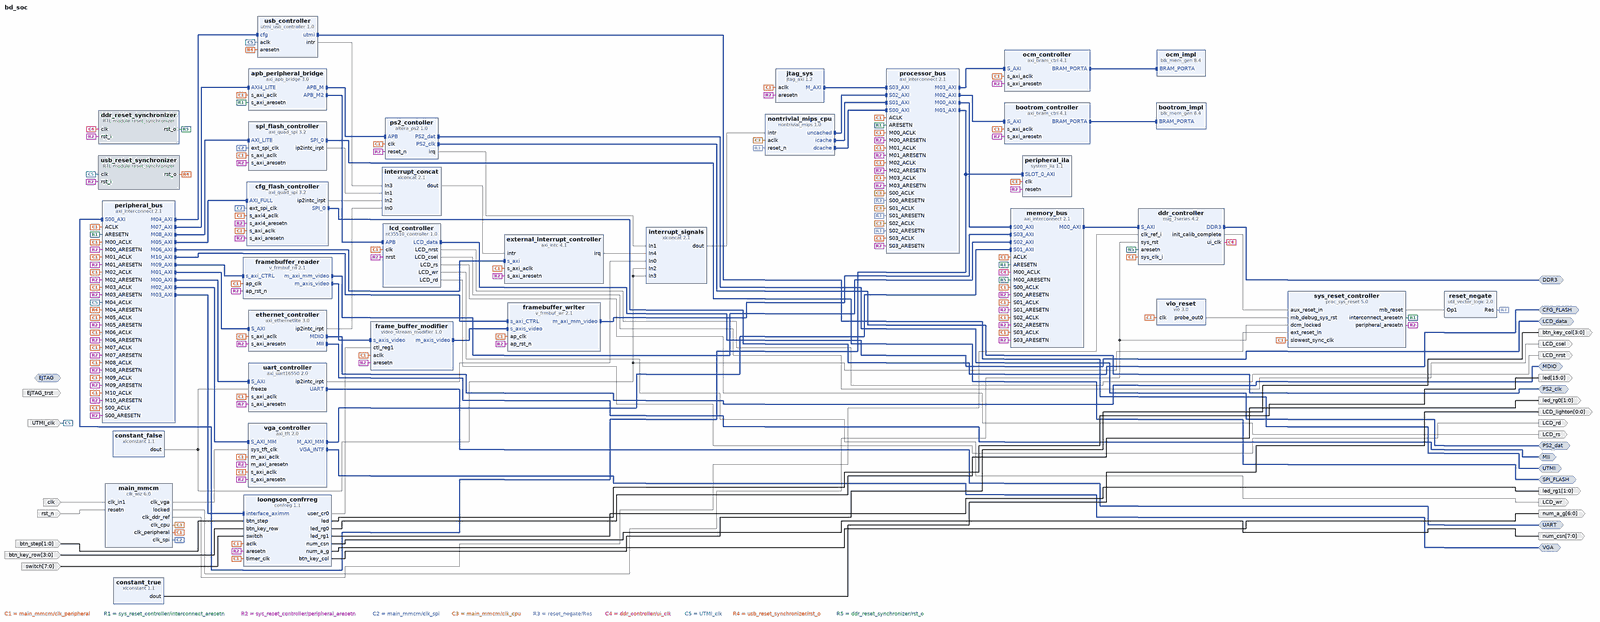
[diagram p0: block diagram of the top level, whole]
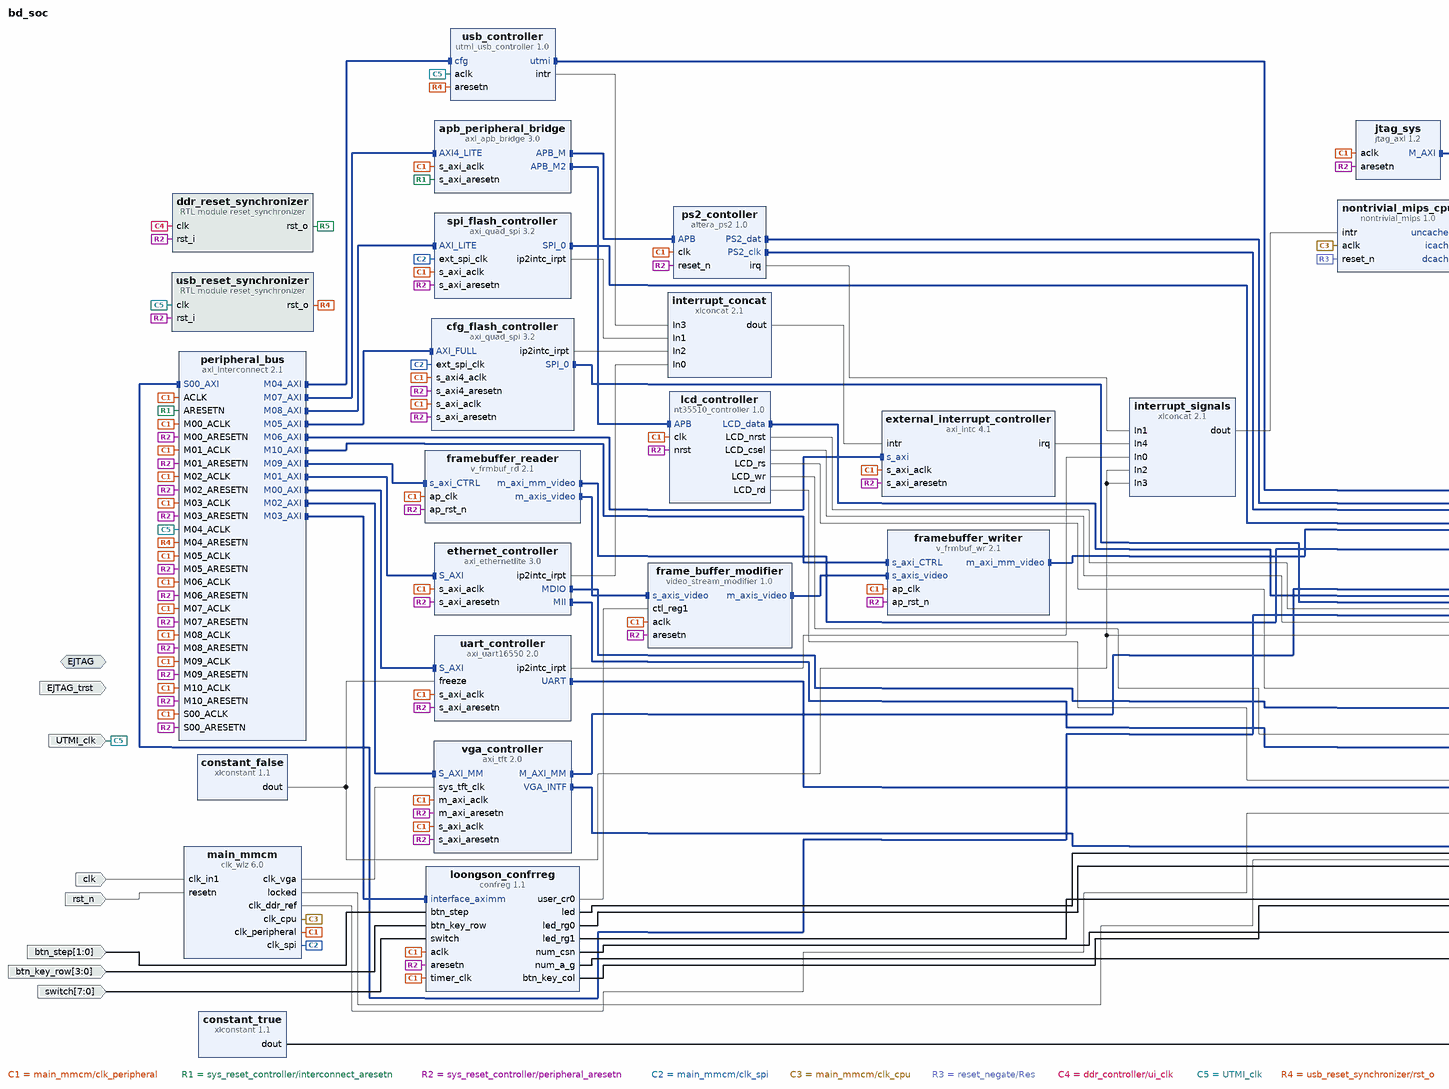
[diagram p1: block diagram of the top level, left part]
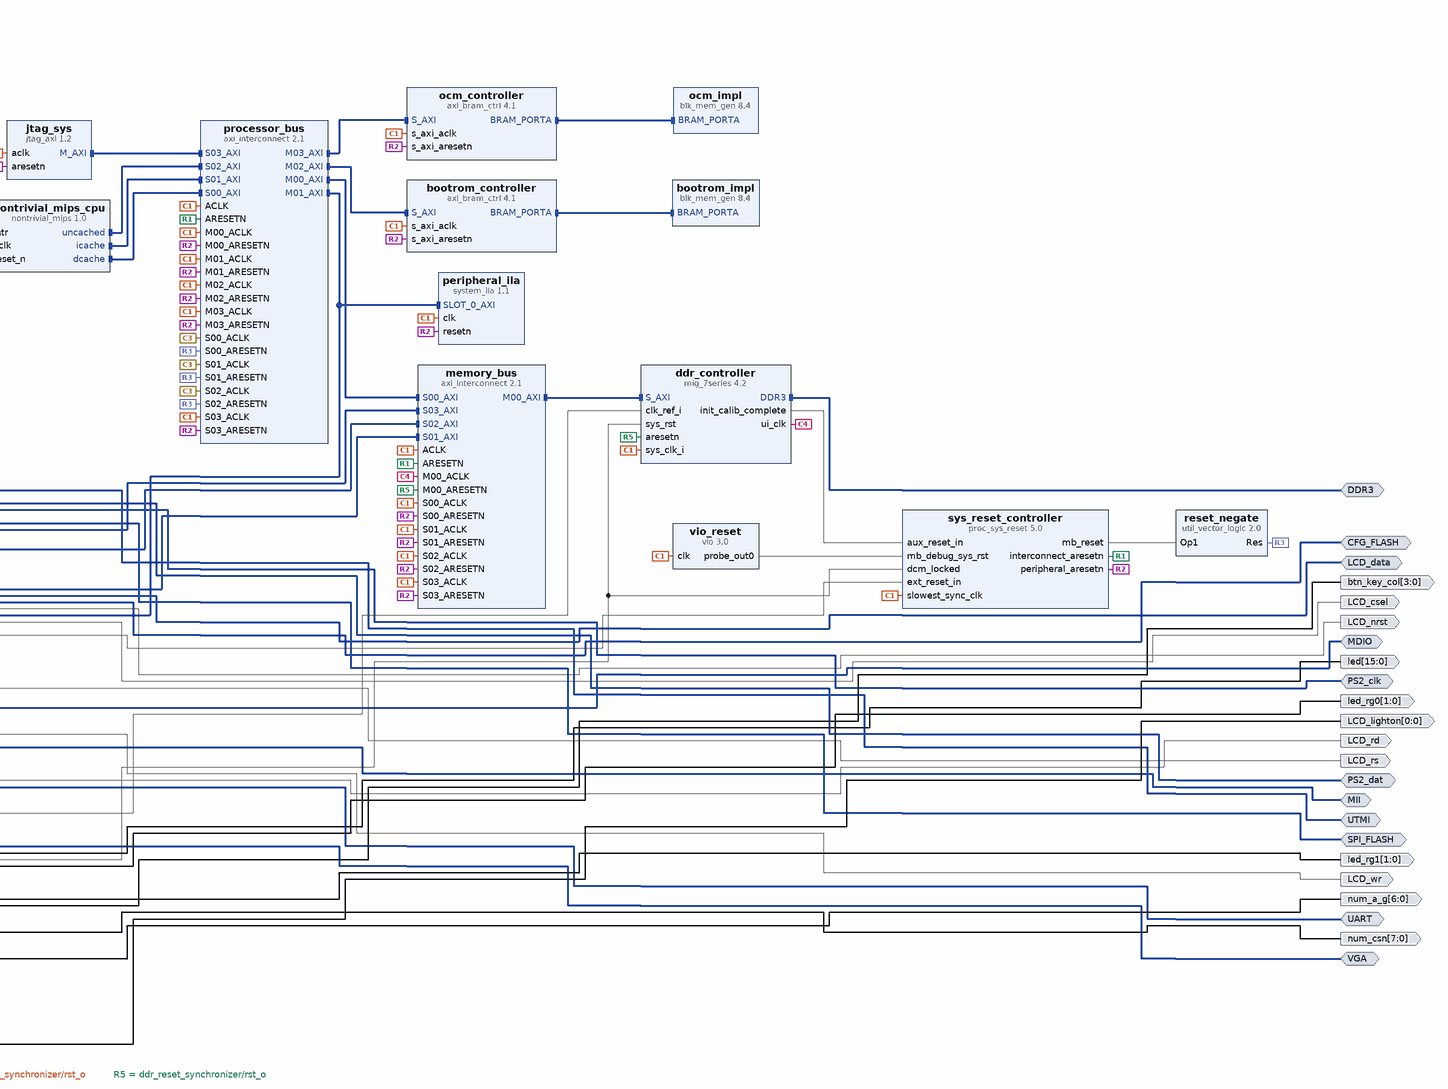
[diagram p2: block diagram of the top level, right part]
# Vivado block design bd_soc, xc7a200tfbg676-2, Vivado 2018.3
create_bd_design bd_soc

create_bd_intf_port -mode Master -vlnv xilinx.com:interface:uart_rtl:1.0 UART
create_bd_intf_port -mode Master -vlnv xilinx.com:interface:vga_rtl:1.0 VGA
create_bd_intf_port -mode Master -vlnv xilinx.com:interface:mii_rtl:1.0 MII
create_bd_intf_port -mode Master -vlnv xilinx.com:interface:mdio_rtl:1.0 MDIO
create_bd_intf_port -mode Master -vlnv xilinx.com:interface:spi_rtl:1.0 SPI_FLASH
create_bd_intf_port -mode Master -vlnv xilinx.com:interface:spi_rtl:1.0 CFG_FLASH
create_bd_intf_port -mode Master -vlnv xilinx.com:interface:ddrx_rtl:1.0 DDR3
create_bd_intf_port -mode Slave -vlnv xilinx.com:interface:jtag_rtl:2.0 EJTAG
create_bd_intf_port -mode Master -vlnv xilinx.com:interface:gpio_rtl:1.0 LCD_data
create_bd_intf_port -mode Master -vlnv xilinx.com:interface:gpio_rtl:1.0 PS2_clk
create_bd_intf_port -mode Master -vlnv xilinx.com:interface:gpio_rtl:1.0 PS2_dat
create_bd_intf_port -mode Master -vlnv harrychen.xyz:user:utmi_rtl:1.0 UTMI
create_bd_port -dir I -type clk clk
set_property -dict {CONFIG.ASSOCIATED_RESET rst_n CONFIG.FREQ_HZ 100000000} [get_bd_ports clk]
create_bd_port -dir I -type rst rst_n
create_bd_port -dir O -from 15 -to 0 led
create_bd_port -dir O -from 1 -to 0 led_rg0
create_bd_port -dir O -from 1 -to 0 led_rg1
create_bd_port -dir O -from 7 -to 0 num_csn
create_bd_port -dir O -from 6 -to 0 num_a_g
create_bd_port -dir O -from 3 -to 0 btn_key_col
create_bd_port -dir I -from 3 -to 0 btn_key_row
create_bd_port -dir I -from 1 -to 0 btn_step
create_bd_port -dir I -from 7 -to 0 switch
create_bd_port -dir O LCD_nrst
create_bd_port -dir O LCD_csel
create_bd_port -dir O LCD_rd
create_bd_port -dir O LCD_rs
create_bd_port -dir O LCD_wr
create_bd_port -dir O -from 0 -to 0 LCD_lighton
create_bd_port -dir I EJTAG_trst
create_bd_port -dir I -type clk UTMI_clk
set_property -dict {CONFIG.FREQ_HZ 60000000} [get_bd_ports UTMI_clk]

create_bd_cell -type ip -vlnv xilinx.com:ip:clk_wiz:6.0 main_mmcm
set_property -dict [list \
  CONFIG.CLKOUT1_JITTER 137.143 \
  CONFIG.CLKOUT1_PHASE_ERROR 98.575 \
  CONFIG.CLKOUT1_REQUESTED_OUT_FREQ 80.000 \
  CONFIG.CLKOUT2_JITTER 114.829 \
  CONFIG.CLKOUT2_PHASE_ERROR 98.575 \
  CONFIG.CLKOUT2_REQUESTED_OUT_FREQ 200.000 \
  CONFIG.CLKOUT2_USED true \
  CONFIG.CLKOUT3_JITTER 175.402 \
  CONFIG.CLKOUT3_PHASE_ERROR 98.575 \
  CONFIG.CLKOUT3_REQUESTED_OUT_FREQ 25.000 \
  CONFIG.CLKOUT3_USED true \
  CONFIG.CLKOUT4_JITTER 183.243 \
  CONFIG.CLKOUT4_PHASE_ERROR 98.575 \
  CONFIG.CLKOUT4_REQUESTED_OUT_FREQ 20.000 \
  CONFIG.CLKOUT4_USED true \
  CONFIG.CLKOUT5_JITTER 130.958 \
  CONFIG.CLKOUT5_PHASE_ERROR 98.575 \
  CONFIG.CLKOUT5_USED true \
  CONFIG.CLK_OUT1_PORT clk_cpu \
  CONFIG.CLK_OUT2_PORT clk_ddr_ref \
  CONFIG.CLK_OUT3_PORT clk_vga \
  CONFIG.CLK_OUT4_PORT clk_spi \
  CONFIG.CLK_OUT5_PORT clk_peripheral \
  CONFIG.MMCM_CLKFBOUT_MULT_F 10.000 \
  CONFIG.MMCM_CLKIN1_PERIOD 10.000 \
  CONFIG.MMCM_CLKIN2_PERIOD 10.000 \
  CONFIG.MMCM_CLKOUT0_DIVIDE_F 12.500 \
  CONFIG.MMCM_CLKOUT1_DIVIDE 5 \
  CONFIG.MMCM_CLKOUT2_DIVIDE 40 \
  CONFIG.MMCM_CLKOUT3_DIVIDE 50 \
  CONFIG.MMCM_CLKOUT4_DIVIDE 10 \
  CONFIG.MMCM_DIVCLK_DIVIDE 1 \
  CONFIG.NUM_OUT_CLKS 5 \
  CONFIG.RESET_PORT resetn \
  CONFIG.RESET_TYPE ACTIVE_LOW \
] [get_bd_cells main_mmcm]
create_bd_cell -type ip -vlnv xilinx.com:ip:proc_sys_reset:5.0 sys_reset_controller
set_property -dict {CONFIG.C_AUX_RESET_HIGH 0} [get_bd_cells sys_reset_controller]
create_bd_cell -type ip -vlnv xilinx.com:ip:axi_interconnect:2.1 processor_bus
set_property -dict [list \
  CONFIG.ENABLE_ADVANCED_OPTIONS 1 \
  CONFIG.NUM_MI 4 \
  CONFIG.NUM_SI 4 \
  CONFIG.S00_ARB_PRIORITY 0 \
  CONFIG.S00_HAS_DATA_FIFO 2 \
  CONFIG.S01_ARB_PRIORITY 0 \
  CONFIG.S01_HAS_DATA_FIFO 2 \
  CONFIG.S02_ARB_PRIORITY 1 \
  CONFIG.S02_HAS_DATA_FIFO 2 \
  CONFIG.S03_ARB_PRIORITY 2 \
  CONFIG.S03_HAS_DATA_FIFO 2 \
  CONFIG.STRATEGY 2 \
] [get_bd_cells processor_bus]
create_bd_cell -type ip -vlnv xilinx.com:ip:axi_interconnect:2.1 peripheral_bus
set_property -dict [list \
  CONFIG.ENABLE_ADVANCED_OPTIONS 0 \
  CONFIG.NUM_MI 11 \
  CONFIG.S00_HAS_DATA_FIFO 2 \
  CONFIG.STRATEGY 2 \
] [get_bd_cells peripheral_bus]
create_bd_cell -type ip -vlnv xilinx.com:ip:axi_uart16550:2.0 uart_controller
create_bd_cell -type ip -vlnv xilinx.com:ip:xlconstant:1.1 constant_false
set_property -dict {CONFIG.CONST_VAL 0} [get_bd_cells constant_false]
create_bd_cell -type ip -vlnv xilinx.com:ip:axi_ethernetlite:3.0 ethernet_controller
create_bd_cell -type ip -vlnv xilinx.com:ip:axi_tft:2.0 vga_controller
set_property -dict {CONFIG.C_EN_I2C_INTF 0 CONFIG.C_MAX_BURST_LEN 128 CONFIG.C_TFT_INTERFACE 0} [get_bd_cells vga_controller]
create_bd_cell -type ip -vlnv xilinx.com:ip:axi_quad_spi:3.2 spi_flash_controller
set_property -dict [list \
  CONFIG.C_FIFO_DEPTH 256 \
  CONFIG.C_SPI_MEMORY 2 \
  CONFIG.C_SPI_MODE 2 \
  CONFIG.C_TYPE_OF_AXI4_INTERFACE 0 \
  CONFIG.C_USE_STARTUP 0 \
  CONFIG.C_XIP_MODE 0 \
] [get_bd_cells spi_flash_controller]
create_bd_cell -type ip -vlnv xilinx.com:ip:axi_quad_spi:3.2 cfg_flash_controller
set_property -dict [list \
  CONFIG.C_SPI_MEMORY 3 \
  CONFIG.C_TYPE_OF_AXI4_INTERFACE 1 \
  CONFIG.C_USE_STARTUP 1 \
  CONFIG.C_XIP_MODE 1 \
] [get_bd_cells cfg_flash_controller]
create_bd_cell -type ip -vlnv xilinx.com:ip:xlconcat:2.1 interrupt_signals
set_property -dict {CONFIG.NUM_PORTS 5} [get_bd_cells interrupt_signals]
create_bd_cell -type ip -vlnv xilinx.com:ip:axi_intc:4.1 external_interrupt_controller
set_property -dict {CONFIG.C_IRQ_CONNECTION 1} [get_bd_cells external_interrupt_controller]
create_bd_cell -type ip -vlnv xilinx.com:ip:jtag_axi:1.2 jtag_sys
create_bd_cell -type ip -vlnv xilinx.com:ip:blk_mem_gen:8.4 bootrom_impl
set_property -dict [list \
  CONFIG.Coe_File ../../../../bootrom.coe \
  CONFIG.EN_SAFETY_CKT false \
  CONFIG.Enable_32bit_Address true \
  CONFIG.Fill_Remaining_Memory_Locations true \
  CONFIG.Load_Init_File true \
  CONFIG.Memory_Type Single_Port_RAM \
  CONFIG.Port_B_Clock 0 \
  CONFIG.Port_B_Enable_Rate 0 \
  CONFIG.Port_B_Write_Rate 0 \
  CONFIG.Read_Width_A 32 \
  CONFIG.Register_PortA_Output_of_Memory_Primitives false \
  CONFIG.Use_RSTA_Pin true \
  CONFIG.Write_Width_A 32 \
  CONFIG.use_bram_block Stand_Alone \
] [get_bd_cells bootrom_impl]
create_bd_cell -type ip -vlnv xilinx.com:ip:axi_bram_ctrl:4.1 bootrom_controller
set_property -dict {CONFIG.SINGLE_PORT_BRAM 1} [get_bd_cells bootrom_controller]
create_bd_cell -type ip -vlnv xilinx.com:ip:util_vector_logic:2.0 reset_negate
set_property -dict {CONFIG.C_OPERATION not CONFIG.C_SIZE 1} [get_bd_cells reset_negate]
create_bd_cell -type ip -vlnv xilinx.com:ip:xlconcat:2.1 interrupt_concat
set_property -dict {CONFIG.NUM_PORTS 4} [get_bd_cells interrupt_concat]
create_bd_cell -type ip -vlnv harrychen.xyz:user:nt35510_controller:1.0 lcd_controller
create_bd_cell -type ip -vlnv harrychen.xyz:user:altera_ps2:1.0 ps2_contoller
create_bd_cell -type ip -vlnv xilinx.com:ip:axi_apb_bridge:3.0 apb_peripheral_bridge
set_property -dict {CONFIG.C_APB_NUM_SLAVES 2 CONFIG.C_M_APB_PROTOCOL apb4} [get_bd_cells apb_peripheral_bridge]
create_bd_cell -type ip -vlnv xilinx.com:ip:xlconstant:1.1 constant_true
create_bd_cell -type ip -vlnv xilinx.com:ip:blk_mem_gen:8.4 ocm_impl
set_property -dict [list \
  CONFIG.EN_SAFETY_CKT false \
  CONFIG.Enable_32bit_Address true \
  CONFIG.Memory_Type Single_Port_RAM \
  CONFIG.Port_B_Clock 0 \
  CONFIG.Port_B_Enable_Rate 0 \
  CONFIG.Port_B_Write_Rate 0 \
  CONFIG.Register_PortA_Output_of_Memory_Primitives false \
  CONFIG.Use_RSTA_Pin true \
  CONFIG.use_bram_block BRAM_Controller \
] [get_bd_cells ocm_impl]
create_bd_cell -type ip -vlnv xilinx.com:ip:axi_bram_ctrl:4.1 ocm_controller
set_property -dict {CONFIG.SINGLE_PORT_BRAM 1} [get_bd_cells ocm_controller]
create_bd_cell -type ip -vlnv xilinx.com:ip:axi_interconnect:2.1 memory_bus
set_property -dict [list \
  CONFIG.NUM_MI 1 \
  CONFIG.NUM_SI 4 \
  CONFIG.S00_HAS_DATA_FIFO 2 \
  CONFIG.S01_HAS_DATA_FIFO 2 \
  CONFIG.S02_HAS_DATA_FIFO 2 \
  CONFIG.S03_HAS_DATA_FIFO 2 \
  CONFIG.STRATEGY 2 \
] [get_bd_cells memory_bus]
create_bd_cell -type ip -vlnv xilinx.com:ip:mig_7series:4.2 ddr_controller
set_property -dict [list \
  CONFIG.BOARD_MIG_PARAM Custom \
  CONFIG.RESET_BOARD_INTERFACE Custom \
  CONFIG.XML_INPUT_FILE mig_a.prj \
] [get_bd_cells ddr_controller]
create_bd_cell -type ip -vlnv xilinx.com:ip:vio:3.0 vio_reset
set_property -dict {CONFIG.C_NUM_PROBE_IN 0} [get_bd_cells vio_reset]
create_bd_cell -type ip -vlnv jiege.ch:user:utmi_usb_controller:1.0 usb_controller
create_bd_cell -type module -reference reset_synchronizer usb_reset_synchronizer
create_bd_cell -type module -reference reset_synchronizer ddr_reset_synchronizer
create_bd_cell -type ip -vlnv harrychen.xyz:user:confreg:1.1 loongson_confrreg
create_bd_cell -type ip -vlnv harrychen.xyz:user:video_stream_modifier:1.0 frame_buffer_modifier
create_bd_cell -type ip -vlnv xilinx.com:ip:v_frmbuf_rd:2.1 framebuffer_reader
set_property -dict [list \
  CONFIG.AXIMM_DATA_WIDTH 64 \
  CONFIG.C_M_AXI_MM_VIDEO_DATA_WIDTH 64 \
  CONFIG.HAS_RGB8 0 \
  CONFIG.HAS_RGBX8 1 \
  CONFIG.MAX_COLS 1024 \
  CONFIG.MAX_ROWS 768 \
  CONFIG.SAMPLES_PER_CLOCK 1 \
] [get_bd_cells framebuffer_reader]
create_bd_cell -type ip -vlnv xilinx.com:ip:v_frmbuf_wr:2.1 framebuffer_writer
set_property -dict [list \
  CONFIG.AXIMM_DATA_WIDTH 64 \
  CONFIG.C_M_AXI_MM_VIDEO_DATA_WIDTH 64 \
  CONFIG.HAS_RGB8 0 \
  CONFIG.HAS_RGBX8 1 \
  CONFIG.MAX_COLS 1024 \
  CONFIG.MAX_ROWS 768 \
  CONFIG.SAMPLES_PER_CLOCK 1 \
] [get_bd_cells framebuffer_writer]
create_bd_cell -type ip -vlnv xilinx.com:ip:system_ila:1.1 peripheral_ila
set_property -dict [list \
  CONFIG.C_NUM_MONITOR_SLOTS 1 \
  CONFIG.C_SLOT 0 \
  CONFIG.C_SLOT_0_APC_EN 0 \
  CONFIG.C_SLOT_0_INTF_TYPE xilinx.com:interface:aximm_rtl:1.0 \
  CONFIG.C_SLOT_1_INTF_TYPE xilinx.com:interface:aximm_rtl:1.0 \
  CONFIG.C_TRIGOUT_EN false \
] [get_bd_cells peripheral_ila]
create_bd_cell -type ip -vlnv harrychen.xyz:user:nontrivial_mips:1.0 nontrivial_mips_cpu

# ---- connections ----

connect_bd_intf_net -intf_net utmi_usb_controller_0_utmi [get_bd_intf_ports UTMI] [get_bd_intf_pins usb_controller/utmi]
connect_bd_intf_net [get_bd_intf_pins peripheral_bus/M03_AXI] [get_bd_intf_pins loongson_confrreg/interface_aximm]
connect_bd_intf_net [get_bd_intf_pins apb_peripheral_bridge/APB_M2] [get_bd_intf_pins lcd_controller/APB]
connect_bd_intf_net [get_bd_intf_pins processor_bus/M01_AXI] [get_bd_intf_pins peripheral_bus/S00_AXI]
connect_bd_intf_net [get_bd_intf_pins processor_bus/M01_AXI] [get_bd_intf_pins peripheral_ila/SLOT_0_AXI]
connect_bd_intf_net [get_bd_intf_ports MDIO] [get_bd_intf_pins ethernet_controller/MDIO]
connect_bd_intf_net -intf_net altera_ps2_0_PS2_dat [get_bd_intf_ports PS2_dat] [get_bd_intf_pins ps2_contoller/PS2_dat]
connect_bd_intf_net [get_bd_intf_pins peripheral_bus/M04_AXI] [get_bd_intf_pins usb_controller/cfg]
connect_bd_intf_net [get_bd_intf_pins apb_peripheral_bridge/APB_M] [get_bd_intf_pins ps2_contoller/APB]
connect_bd_intf_net [get_bd_intf_pins processor_bus/M03_AXI] [get_bd_intf_pins ocm_controller/S_AXI]
connect_bd_intf_net [get_bd_intf_pins nontrivial_mips_cpu/uncached] [get_bd_intf_pins processor_bus/S02_AXI]
connect_bd_intf_net [get_bd_intf_pins framebuffer_writer/s_axi_CTRL] [get_bd_intf_pins peripheral_bus/M10_AXI]
connect_bd_intf_net [get_bd_intf_pins vga_controller/M_AXI_MM] [get_bd_intf_pins memory_bus/S01_AXI]
connect_bd_intf_net [get_bd_intf_pins peripheral_bus/M08_AXI] [get_bd_intf_pins spi_flash_controller/AXI_LITE]
connect_bd_intf_net [get_bd_intf_pins peripheral_bus/M05_AXI] [get_bd_intf_pins cfg_flash_controller/AXI_FULL]
connect_bd_intf_net [get_bd_intf_pins peripheral_bus/M00_AXI] [get_bd_intf_pins uart_controller/S_AXI]
connect_bd_intf_net -intf_net altera_ps2_0_PS2_clk [get_bd_intf_ports PS2_clk] [get_bd_intf_pins ps2_contoller/PS2_clk]
connect_bd_intf_net [get_bd_intf_pins processor_bus/M02_AXI] [get_bd_intf_pins bootrom_controller/S_AXI]
connect_bd_intf_net [get_bd_intf_pins peripheral_bus/M02_AXI] [get_bd_intf_pins vga_controller/S_AXI_MM]
connect_bd_intf_net [get_bd_intf_pins framebuffer_reader/s_axi_CTRL] [get_bd_intf_pins peripheral_bus/M09_AXI]
connect_bd_intf_net -intf_net axi_bram_ctrl_0_BRAM_PORTA [get_bd_intf_pins bootrom_controller/BRAM_PORTA] [get_bd_intf_pins bootrom_impl/BRAM_PORTA]
connect_bd_intf_net [get_bd_intf_ports VGA] [get_bd_intf_pins vga_controller/VGA_INTF]
connect_bd_intf_net [get_bd_intf_pins peripheral_bus/M01_AXI] [get_bd_intf_pins ethernet_controller/S_AXI]
connect_bd_intf_net [get_bd_intf_pins peripheral_bus/M07_AXI] [get_bd_intf_pins apb_peripheral_bridge/AXI4_LITE]
connect_bd_intf_net -intf_net mig_7series_0_DDR3 [get_bd_intf_ports DDR3] [get_bd_intf_pins ddr_controller/DDR3]
connect_bd_intf_net [get_bd_intf_pins processor_bus/M00_AXI] [get_bd_intf_pins memory_bus/S00_AXI]
connect_bd_intf_net [get_bd_intf_pins jtag_sys/M_AXI] [get_bd_intf_pins processor_bus/S03_AXI]
connect_bd_intf_net [get_bd_intf_ports UART] [get_bd_intf_pins uart_controller/UART]
connect_bd_intf_net [get_bd_intf_ports SPI_FLASH] [get_bd_intf_pins spi_flash_controller/SPI_0]
connect_bd_intf_net -intf_net nt35510_controller_0_LCD_data [get_bd_intf_ports LCD_data] [get_bd_intf_pins lcd_controller/LCD_data]
connect_bd_intf_net [get_bd_intf_pins memory_bus/M00_AXI] [get_bd_intf_pins ddr_controller/S_AXI]
connect_bd_intf_net [get_bd_intf_ports MII] [get_bd_intf_pins ethernet_controller/MII]
connect_bd_intf_net [get_bd_intf_pins ocm_controller/BRAM_PORTA] [get_bd_intf_pins ocm_impl/BRAM_PORTA]
connect_bd_intf_net [get_bd_intf_ports CFG_FLASH] [get_bd_intf_pins cfg_flash_controller/SPI_0]
connect_bd_intf_net [get_bd_intf_pins peripheral_bus/M06_AXI] [get_bd_intf_pins external_interrupt_controller/s_axi]
connect_bd_intf_net [get_bd_intf_pins frame_buffer_modifier/m_axis_video] [get_bd_intf_pins framebuffer_writer/s_axis_video]
connect_bd_intf_net -intf_net v_frmbuf_wr_0_m_axi_mm_video [get_bd_intf_pins framebuffer_writer/m_axi_mm_video] [get_bd_intf_pins memory_bus/S03_AXI]
connect_bd_intf_net -intf_net v_frmbuf_rd_0_m_axi_mm_video [get_bd_intf_pins framebuffer_reader/m_axi_mm_video] [get_bd_intf_pins memory_bus/S02_AXI]
connect_bd_intf_net -intf_net v_frmbuf_rd_0_m_axis_video [get_bd_intf_pins framebuffer_reader/m_axis_video] [get_bd_intf_pins frame_buffer_modifier/s_axis_video]
connect_bd_intf_net [get_bd_intf_pins nontrivial_mips_cpu/icache] [get_bd_intf_pins processor_bus/S01_AXI]
connect_bd_intf_net [get_bd_intf_pins nontrivial_mips_cpu/dcache] [get_bd_intf_pins processor_bus/S00_AXI]
connect_bd_net -net confreg_0_led [get_bd_pins loongson_confrreg/led] [get_bd_ports led]
connect_bd_net -net confreg_0_led_rg0 [get_bd_pins loongson_confrreg/led_rg0] [get_bd_ports led_rg0]
connect_bd_net -net confreg_0_led_rg1 [get_bd_pins loongson_confrreg/led_rg1] [get_bd_ports led_rg1]
connect_bd_net -net confreg_0_num_csn [get_bd_pins loongson_confrreg/num_csn] [get_bd_ports num_csn]
connect_bd_net -net confreg_0_num_a_g [get_bd_pins loongson_confrreg/num_a_g] [get_bd_ports num_a_g]
connect_bd_net -net confreg_0_btn_key_col [get_bd_pins loongson_confrreg/btn_key_col] [get_bd_ports btn_key_col]
connect_bd_net [get_bd_ports btn_step] [get_bd_pins loongson_confrreg/btn_step]
connect_bd_net [get_bd_ports btn_key_row] [get_bd_pins loongson_confrreg/btn_key_row]
connect_bd_net [get_bd_ports switch] [get_bd_pins loongson_confrreg/switch]
connect_bd_net -net ddr_controller_ui_clk [get_bd_pins main_mmcm/clk_peripheral] \
  [get_bd_pins peripheral_bus/ACLK] [get_bd_pins peripheral_bus/S00_ACLK] [get_bd_pins uart_controller/s_axi_aclk] \
  [get_bd_pins ethernet_controller/s_axi_aclk] [get_bd_pins peripheral_bus/M00_ACLK] [get_bd_pins peripheral_bus/M01_ACLK] \
  [get_bd_pins vga_controller/s_axi_aclk] [get_bd_pins vga_controller/m_axi_aclk] [get_bd_pins peripheral_bus/M03_ACLK] \
  [get_bd_pins peripheral_bus/M02_ACLK] [get_bd_pins spi_flash_controller/s_axi_aclk] \
  [get_bd_pins cfg_flash_controller/s_axi4_aclk] [get_bd_pins external_interrupt_controller/s_axi_aclk] \
  [get_bd_pins jtag_sys/aclk] [get_bd_pins processor_bus/M00_ACLK] [get_bd_pins processor_bus/M01_ACLK] \
  [get_bd_pins bootrom_controller/s_axi_aclk] [get_bd_pins peripheral_bus/M05_ACLK] [get_bd_pins peripheral_bus/M06_ACLK] \
  [get_bd_pins processor_bus/M02_ACLK] [get_bd_pins cfg_flash_controller/s_axi_aclk] [get_bd_pins peripheral_bus/M07_ACLK] \
  [get_bd_pins peripheral_bus/M08_ACLK] [get_bd_pins peripheral_bus/M09_ACLK] [get_bd_pins processor_bus/M03_ACLK] \
  [get_bd_pins sys_reset_controller/slowest_sync_clk] [get_bd_pins apb_peripheral_bridge/s_axi_aclk] \
  [get_bd_pins ps2_contoller/clk] [get_bd_pins lcd_controller/clk] [get_bd_pins processor_bus/ACLK] \
  [get_bd_pins processor_bus/S03_ACLK] [get_bd_pins ocm_controller/s_axi_aclk] [get_bd_pins memory_bus/ACLK] \
  [get_bd_pins memory_bus/S00_ACLK] [get_bd_pins memory_bus/S01_ACLK] [get_bd_pins ddr_controller/sys_clk_i] \
  [get_bd_pins vio_reset/clk] [get_bd_pins loongson_confrreg/aclk] [get_bd_pins loongson_confrreg/timer_clk] \
  [get_bd_pins framebuffer_reader/ap_clk] [get_bd_pins framebuffer_writer/ap_clk] [get_bd_pins peripheral_bus/M10_ACLK] \
  [get_bd_pins memory_bus/S02_ACLK] [get_bd_pins memory_bus/S03_ACLK] [get_bd_pins frame_buffer_modifier/aclk] \
  [get_bd_pins peripheral_ila/clk]
connect_bd_net -net proc_sys_reset_0_interconnect_aresetn [get_bd_pins sys_reset_controller/interconnect_aresetn] \
  [get_bd_pins peripheral_bus/ARESETN] [get_bd_pins apb_peripheral_bridge/s_axi_aresetn] [get_bd_pins processor_bus/ARESETN] \
  [get_bd_pins memory_bus/ARESETN]
connect_bd_net -net proc_sys_reset_0_peripheral_aresetn [get_bd_pins sys_reset_controller/peripheral_aresetn] \
  [get_bd_pins peripheral_bus/S00_ARESETN] [get_bd_pins uart_controller/s_axi_aresetn] \
  [get_bd_pins ethernet_controller/s_axi_aresetn] [get_bd_pins peripheral_bus/M00_ARESETN] \
  [get_bd_pins peripheral_bus/M01_ARESETN] [get_bd_pins vga_controller/s_axi_aresetn] \
  [get_bd_pins vga_controller/m_axi_aresetn] [get_bd_pins peripheral_bus/M03_ARESETN] \
  [get_bd_pins peripheral_bus/M02_ARESETN] [get_bd_pins spi_flash_controller/s_axi_aresetn] \
  [get_bd_pins cfg_flash_controller/s_axi4_aresetn] [get_bd_pins external_interrupt_controller/s_axi_aresetn] \
  [get_bd_pins jtag_sys/aresetn] [get_bd_pins processor_bus/M00_ARESETN] [get_bd_pins processor_bus/M01_ARESETN] \
  [get_bd_pins bootrom_controller/s_axi_aresetn] [get_bd_pins peripheral_bus/M05_ARESETN] \
  [get_bd_pins peripheral_bus/M06_ARESETN] [get_bd_pins processor_bus/M02_ARESETN] [get_bd_pins peripheral_bus/M08_ARESETN] \
  [get_bd_pins peripheral_bus/M09_ARESETN] [get_bd_pins processor_bus/M03_ARESETN] [get_bd_pins peripheral_bus/M07_ARESETN] \
  [get_bd_pins ps2_contoller/reset_n] [get_bd_pins lcd_controller/nrst] [get_bd_pins processor_bus/S03_ARESETN] \
  [get_bd_pins ocm_controller/s_axi_aresetn] [get_bd_pins cfg_flash_controller/s_axi_aresetn] \
  [get_bd_pins memory_bus/S00_ARESETN] [get_bd_pins memory_bus/S01_ARESETN] [get_bd_pins usb_reset_synchronizer/rst_i] \
  [get_bd_pins ddr_reset_synchronizer/rst_i] [get_bd_pins loongson_confrreg/aresetn] \
  [get_bd_pins framebuffer_reader/ap_rst_n] [get_bd_pins peripheral_bus/M10_ARESETN] \
  [get_bd_pins framebuffer_writer/ap_rst_n] [get_bd_pins memory_bus/S02_ARESETN] [get_bd_pins memory_bus/S03_ARESETN] \
  [get_bd_pins frame_buffer_modifier/aresetn] [get_bd_pins peripheral_ila/resetn]
connect_bd_net -net xlconstant_0_dout [get_bd_pins constant_false/dout] \
  [get_bd_pins uart_controller/freeze] [get_bd_pins interrupt_signals/In2] [get_bd_pins interrupt_signals/In3] \
  [get_bd_pins sys_reset_controller/ext_reset_in]
connect_bd_net [get_bd_pins main_mmcm/clk_vga] [get_bd_pins vga_controller/sys_tft_clk]
connect_bd_net [get_bd_pins main_mmcm/clk_spi] [get_bd_pins spi_flash_controller/ext_spi_clk] [get_bd_pins cfg_flash_controller/ext_spi_clk]
connect_bd_net [get_bd_pins uart_controller/ip2intc_irpt] [get_bd_pins interrupt_signals/In0]
connect_bd_net -net axi_intc_0_irq [get_bd_pins external_interrupt_controller/irq] [get_bd_pins interrupt_signals/In4]
connect_bd_net -net clk_wiz_0_clk_cpu [get_bd_pins main_mmcm/clk_cpu] \
  [get_bd_pins processor_bus/S00_ACLK] [get_bd_pins processor_bus/S01_ACLK] [get_bd_pins processor_bus/S02_ACLK] \
  [get_bd_pins nontrivial_mips_cpu/aclk]
connect_bd_net [get_bd_pins sys_reset_controller/mb_reset] [get_bd_pins reset_negate/Op1]
connect_bd_net [get_bd_pins reset_negate/Res] \
  [get_bd_pins processor_bus/S00_ARESETN] [get_bd_pins processor_bus/S01_ARESETN] [get_bd_pins processor_bus/S02_ARESETN] \
  [get_bd_pins nontrivial_mips_cpu/reset_n]
connect_bd_net [get_bd_pins ethernet_controller/ip2intc_irpt] [get_bd_pins interrupt_concat/In0]
connect_bd_net [get_bd_pins spi_flash_controller/ip2intc_irpt] [get_bd_pins interrupt_concat/In1]
connect_bd_net [get_bd_pins cfg_flash_controller/ip2intc_irpt] [get_bd_pins interrupt_concat/In2]
connect_bd_net [get_bd_pins interrupt_concat/dout] [get_bd_pins external_interrupt_controller/intr]
connect_bd_net -net nt35510_controller_0_LCD_nrst [get_bd_pins lcd_controller/LCD_nrst] [get_bd_ports LCD_nrst]
connect_bd_net -net nt35510_controller_0_LCD_csel [get_bd_pins lcd_controller/LCD_csel] [get_bd_ports LCD_csel]
connect_bd_net -net nt35510_controller_0_LCD_rs [get_bd_pins lcd_controller/LCD_rs] [get_bd_ports LCD_rs]
connect_bd_net -net nt35510_controller_0_LCD_wr [get_bd_pins lcd_controller/LCD_wr] [get_bd_ports LCD_wr]
connect_bd_net -net nt35510_controller_0_LCD_rd [get_bd_pins lcd_controller/LCD_rd] [get_bd_ports LCD_rd]
connect_bd_net [get_bd_pins ps2_contoller/irq] [get_bd_pins interrupt_signals/In1]
connect_bd_net [get_bd_pins constant_true/dout] [get_bd_ports LCD_lighton]
connect_bd_net [get_bd_pins interrupt_signals/dout] [get_bd_pins nontrivial_mips_cpu/intr]
connect_bd_net [get_bd_pins main_mmcm/locked] [get_bd_pins sys_reset_controller/dcm_locked] [get_bd_pins ddr_controller/sys_rst]
connect_bd_net [get_bd_pins main_mmcm/clk_ddr_ref] [get_bd_pins ddr_controller/clk_ref_i]
connect_bd_net -net mig_7series_0_ui_clk [get_bd_pins ddr_controller/ui_clk] \
  [get_bd_pins memory_bus/M00_ACLK] [get_bd_pins ddr_reset_synchronizer/clk]
connect_bd_net -net mig_7series_0_init_calib_complete [get_bd_pins ddr_controller/init_calib_complete] [get_bd_pins sys_reset_controller/aux_reset_in]
connect_bd_net [get_bd_ports clk] [get_bd_pins main_mmcm/clk_in1]
connect_bd_net [get_bd_ports rst_n] [get_bd_pins main_mmcm/resetn]
connect_bd_net [get_bd_pins vio_reset/probe_out0] [get_bd_pins sys_reset_controller/mb_debug_sys_rst]
connect_bd_net [get_bd_ports UTMI_clk] \
  [get_bd_pins peripheral_bus/M04_ACLK] [get_bd_pins usb_controller/aclk] [get_bd_pins usb_reset_synchronizer/clk]
connect_bd_net [get_bd_pins usb_controller/intr] [get_bd_pins interrupt_concat/In3]
connect_bd_net -net reset_synchronizer_0_rst_o [get_bd_pins usb_reset_synchronizer/rst_o] \
  [get_bd_pins usb_controller/aresetn] [get_bd_pins peripheral_bus/M04_ARESETN]
connect_bd_net -net reset_synchronizer_0_rst_o1 [get_bd_pins ddr_reset_synchronizer/rst_o] \
  [get_bd_pins memory_bus/M00_ARESETN] [get_bd_pins ddr_controller/aresetn]
connect_bd_net [get_bd_pins loongson_confrreg/user_cr0] [get_bd_pins frame_buffer_modifier/ctl_reg1]

# ---- address map ----
assign_bd_address -offset 0x00000000 -range 128M -target_address_space [get_bd_addr_spaces framebuffer_reader/Data_m_axi_mm_video] [get_bd_addr_segs ddr_controller/memmap/memaddr]
assign_bd_address -offset 0x00000000 -range 128M -target_address_space [get_bd_addr_spaces framebuffer_writer/Data_m_axi_mm_video] [get_bd_addr_segs ddr_controller/memmap/memaddr]
assign_bd_address -offset 0x00000000 -range 128M -target_address_space [get_bd_addr_spaces jtag_sys/Data] [get_bd_addr_segs ddr_controller/memmap/memaddr]
assign_bd_address -offset 0x08000000 -range 64K -target_address_space [get_bd_addr_spaces jtag_sys/Data] [get_bd_addr_segs ocm_controller/S_AXI/Mem0]
assign_bd_address -offset 0x1A000000 -range 16M -target_address_space [get_bd_addr_spaces jtag_sys/Data] [get_bd_addr_segs cfg_flash_controller/aximm/MEM0]
assign_bd_address -offset 0x1C000000 -range 64K -target_address_space [get_bd_addr_spaces jtag_sys/Data] [get_bd_addr_segs ethernet_controller/S_AXI/Reg]
assign_bd_address -offset 0x1C010000 -range 64K -target_address_space [get_bd_addr_spaces jtag_sys/Data] [get_bd_addr_segs vga_controller/S_AXI_MM/Reg]
assign_bd_address -offset 0x1C020000 -range 4K -target_address_space [get_bd_addr_spaces jtag_sys/Data] [get_bd_addr_segs ps2_contoller/APB/Reg]
assign_bd_address -offset 0x1C030000 -range 4K -target_address_space [get_bd_addr_spaces jtag_sys/Data] [get_bd_addr_segs lcd_controller/APB/Reg]
assign_bd_address -offset 0x1C040000 -range 4K -target_address_space [get_bd_addr_spaces jtag_sys/Data] [get_bd_addr_segs spi_flash_controller/AXI_LITE/Reg]
assign_bd_address -offset 0x1C050000 -range 4K -target_address_space [get_bd_addr_spaces jtag_sys/Data] [get_bd_addr_segs usb_controller/cfg/reg0]
assign_bd_address -offset 0x1C060000 -range 64K -target_address_space [get_bd_addr_spaces jtag_sys/Data] [get_bd_addr_segs framebuffer_reader/s_axi_CTRL/Reg]
assign_bd_address -offset 0x1C070000 -range 64K -target_address_space [get_bd_addr_spaces jtag_sys/Data] [get_bd_addr_segs framebuffer_writer/s_axi_CTRL/Reg]
assign_bd_address -offset 0x1D000000 -range 64K -target_address_space [get_bd_addr_spaces jtag_sys/Data] [get_bd_addr_segs external_interrupt_controller/S_AXI/Reg]
assign_bd_address -offset 0x1FC00000 -range 128K -target_address_space [get_bd_addr_spaces jtag_sys/Data] [get_bd_addr_segs bootrom_controller/S_AXI/Mem0]
assign_bd_address -offset 0x1FD02000 -range 8K -target_address_space [get_bd_addr_spaces jtag_sys/Data] [get_bd_addr_segs uart_controller/S_AXI/Reg]
assign_bd_address -offset 0x1FF00000 -range 64K -target_address_space [get_bd_addr_spaces jtag_sys/Data] [get_bd_addr_segs loongson_confrreg/interface_aximm/reg0]
assign_bd_address -offset 0x00000000 -range 128M -target_address_space [get_bd_addr_spaces nontrivial_mips_cpu/dcache] [get_bd_addr_segs ddr_controller/memmap/memaddr]
assign_bd_address -offset 0x08000000 -range 64K -target_address_space [get_bd_addr_spaces nontrivial_mips_cpu/dcache] [get_bd_addr_segs ocm_controller/S_AXI/Mem0]
assign_bd_address -offset 0x1A000000 -range 16M -target_address_space [get_bd_addr_spaces nontrivial_mips_cpu/dcache] [get_bd_addr_segs cfg_flash_controller/aximm/MEM0]
assign_bd_address -offset 0x1C000000 -range 64K -target_address_space [get_bd_addr_spaces nontrivial_mips_cpu/dcache] [get_bd_addr_segs ethernet_controller/S_AXI/Reg]
assign_bd_address -offset 0x1C010000 -range 64K -target_address_space [get_bd_addr_spaces nontrivial_mips_cpu/dcache] [get_bd_addr_segs vga_controller/S_AXI_MM/Reg]
assign_bd_address -offset 0x1C020000 -range 4K -target_address_space [get_bd_addr_spaces nontrivial_mips_cpu/dcache] [get_bd_addr_segs ps2_contoller/APB/Reg]
assign_bd_address -offset 0x1C030000 -range 4K -target_address_space [get_bd_addr_spaces nontrivial_mips_cpu/dcache] [get_bd_addr_segs lcd_controller/APB/Reg]
assign_bd_address -offset 0x1C040000 -range 4K -target_address_space [get_bd_addr_spaces nontrivial_mips_cpu/dcache] [get_bd_addr_segs spi_flash_controller/AXI_LITE/Reg]
assign_bd_address -offset 0x1C050000 -range 4K -target_address_space [get_bd_addr_spaces nontrivial_mips_cpu/dcache] [get_bd_addr_segs usb_controller/cfg/reg0]
assign_bd_address -offset 0x1C060000 -range 64K -target_address_space [get_bd_addr_spaces nontrivial_mips_cpu/dcache] [get_bd_addr_segs framebuffer_reader/s_axi_CTRL/Reg]
assign_bd_address -offset 0x1C070000 -range 64K -target_address_space [get_bd_addr_spaces nontrivial_mips_cpu/dcache] [get_bd_addr_segs framebuffer_writer/s_axi_CTRL/Reg]
assign_bd_address -offset 0x1D000000 -range 64K -target_address_space [get_bd_addr_spaces nontrivial_mips_cpu/dcache] [get_bd_addr_segs external_interrupt_controller/S_AXI/Reg]
assign_bd_address -offset 0x1FC00000 -range 128K -target_address_space [get_bd_addr_spaces nontrivial_mips_cpu/dcache] [get_bd_addr_segs bootrom_controller/S_AXI/Mem0]
assign_bd_address -offset 0x1FD02000 -range 8K -target_address_space [get_bd_addr_spaces nontrivial_mips_cpu/dcache] [get_bd_addr_segs uart_controller/S_AXI/Reg]
assign_bd_address -offset 0x1FF00000 -range 64K -target_address_space [get_bd_addr_spaces nontrivial_mips_cpu/dcache] [get_bd_addr_segs loongson_confrreg/interface_aximm/reg0]
assign_bd_address -offset 0x00000000 -range 128M -target_address_space [get_bd_addr_spaces nontrivial_mips_cpu/icache] [get_bd_addr_segs ddr_controller/memmap/memaddr]
assign_bd_address -offset 0x08000000 -range 64K -target_address_space [get_bd_addr_spaces nontrivial_mips_cpu/icache] [get_bd_addr_segs ocm_controller/S_AXI/Mem0]
assign_bd_address -offset 0x1A000000 -range 16M -target_address_space [get_bd_addr_spaces nontrivial_mips_cpu/icache] [get_bd_addr_segs cfg_flash_controller/aximm/MEM0]
assign_bd_address -offset 0x1C000000 -range 64K -target_address_space [get_bd_addr_spaces nontrivial_mips_cpu/icache] [get_bd_addr_segs ethernet_controller/S_AXI/Reg]
assign_bd_address -offset 0x1C010000 -range 64K -target_address_space [get_bd_addr_spaces nontrivial_mips_cpu/icache] [get_bd_addr_segs vga_controller/S_AXI_MM/Reg]
assign_bd_address -offset 0x1C020000 -range 4K -target_address_space [get_bd_addr_spaces nontrivial_mips_cpu/icache] [get_bd_addr_segs ps2_contoller/APB/Reg]
assign_bd_address -offset 0x1C030000 -range 4K -target_address_space [get_bd_addr_spaces nontrivial_mips_cpu/icache] [get_bd_addr_segs lcd_controller/APB/Reg]
assign_bd_address -offset 0x1C040000 -range 4K -target_address_space [get_bd_addr_spaces nontrivial_mips_cpu/icache] [get_bd_addr_segs spi_flash_controller/AXI_LITE/Reg]
assign_bd_address -offset 0x1C050000 -range 4K -target_address_space [get_bd_addr_spaces nontrivial_mips_cpu/icache] [get_bd_addr_segs usb_controller/cfg/reg0]
assign_bd_address -offset 0x1C060000 -range 64K -target_address_space [get_bd_addr_spaces nontrivial_mips_cpu/icache] [get_bd_addr_segs framebuffer_reader/s_axi_CTRL/Reg]
assign_bd_address -offset 0x1C070000 -range 64K -target_address_space [get_bd_addr_spaces nontrivial_mips_cpu/icache] [get_bd_addr_segs framebuffer_writer/s_axi_CTRL/Reg]
assign_bd_address -offset 0x1D000000 -range 64K -target_address_space [get_bd_addr_spaces nontrivial_mips_cpu/icache] [get_bd_addr_segs external_interrupt_controller/S_AXI/Reg]
assign_bd_address -offset 0x1FC00000 -range 128K -target_address_space [get_bd_addr_spaces nontrivial_mips_cpu/icache] [get_bd_addr_segs bootrom_controller/S_AXI/Mem0]
assign_bd_address -offset 0x1FD02000 -range 8K -target_address_space [get_bd_addr_spaces nontrivial_mips_cpu/icache] [get_bd_addr_segs uart_controller/S_AXI/Reg]
assign_bd_address -offset 0x1FF00000 -range 64K -target_address_space [get_bd_addr_spaces nontrivial_mips_cpu/icache] [get_bd_addr_segs loongson_confrreg/interface_aximm/reg0]
assign_bd_address -offset 0x00000000 -range 128M -target_address_space [get_bd_addr_spaces nontrivial_mips_cpu/uncached] [get_bd_addr_segs ddr_controller/memmap/memaddr]
assign_bd_address -offset 0x08000000 -range 64K -target_address_space [get_bd_addr_spaces nontrivial_mips_cpu/uncached] [get_bd_addr_segs ocm_controller/S_AXI/Mem0]
assign_bd_address -offset 0x1A000000 -range 16M -target_address_space [get_bd_addr_spaces nontrivial_mips_cpu/uncached] [get_bd_addr_segs cfg_flash_controller/aximm/MEM0]
assign_bd_address -offset 0x1C000000 -range 64K -target_address_space [get_bd_addr_spaces nontrivial_mips_cpu/uncached] [get_bd_addr_segs ethernet_controller/S_AXI/Reg]
assign_bd_address -offset 0x1C010000 -range 64K -target_address_space [get_bd_addr_spaces nontrivial_mips_cpu/uncached] [get_bd_addr_segs vga_controller/S_AXI_MM/Reg]
assign_bd_address -offset 0x1C020000 -range 4K -target_address_space [get_bd_addr_spaces nontrivial_mips_cpu/uncached] [get_bd_addr_segs ps2_contoller/APB/Reg]
assign_bd_address -offset 0x1C030000 -range 4K -target_address_space [get_bd_addr_spaces nontrivial_mips_cpu/uncached] [get_bd_addr_segs lcd_controller/APB/Reg]
assign_bd_address -offset 0x1C040000 -range 4K -target_address_space [get_bd_addr_spaces nontrivial_mips_cpu/uncached] [get_bd_addr_segs spi_flash_controller/AXI_LITE/Reg]
assign_bd_address -offset 0x1C050000 -range 4K -target_address_space [get_bd_addr_spaces nontrivial_mips_cpu/uncached] [get_bd_addr_segs usb_controller/cfg/reg0]
assign_bd_address -offset 0x1C060000 -range 64K -target_address_space [get_bd_addr_spaces nontrivial_mips_cpu/uncached] [get_bd_addr_segs framebuffer_reader/s_axi_CTRL/Reg]
assign_bd_address -offset 0x1C070000 -range 64K -target_address_space [get_bd_addr_spaces nontrivial_mips_cpu/uncached] [get_bd_addr_segs framebuffer_writer/s_axi_CTRL/Reg]
assign_bd_address -offset 0x1D000000 -range 64K -target_address_space [get_bd_addr_spaces nontrivial_mips_cpu/uncached] [get_bd_addr_segs external_interrupt_controller/S_AXI/Reg]
assign_bd_address -offset 0x1FC00000 -range 128K -target_address_space [get_bd_addr_spaces nontrivial_mips_cpu/uncached] [get_bd_addr_segs bootrom_controller/S_AXI/Mem0]
assign_bd_address -offset 0x1FD02000 -range 8K -target_address_space [get_bd_addr_spaces nontrivial_mips_cpu/uncached] [get_bd_addr_segs uart_controller/S_AXI/Reg]
assign_bd_address -offset 0x1FF00000 -range 64K -target_address_space [get_bd_addr_spaces nontrivial_mips_cpu/uncached] [get_bd_addr_segs loongson_confrreg/interface_aximm/reg0]
assign_bd_address -offset 0x00000000 -range 128M -target_address_space [get_bd_addr_spaces vga_controller/Video_data] [get_bd_addr_segs ddr_controller/memmap/memaddr]

validate_bd_design
save_bd_design
